# EAGLE design receiver (EAGLE 7.4.0)
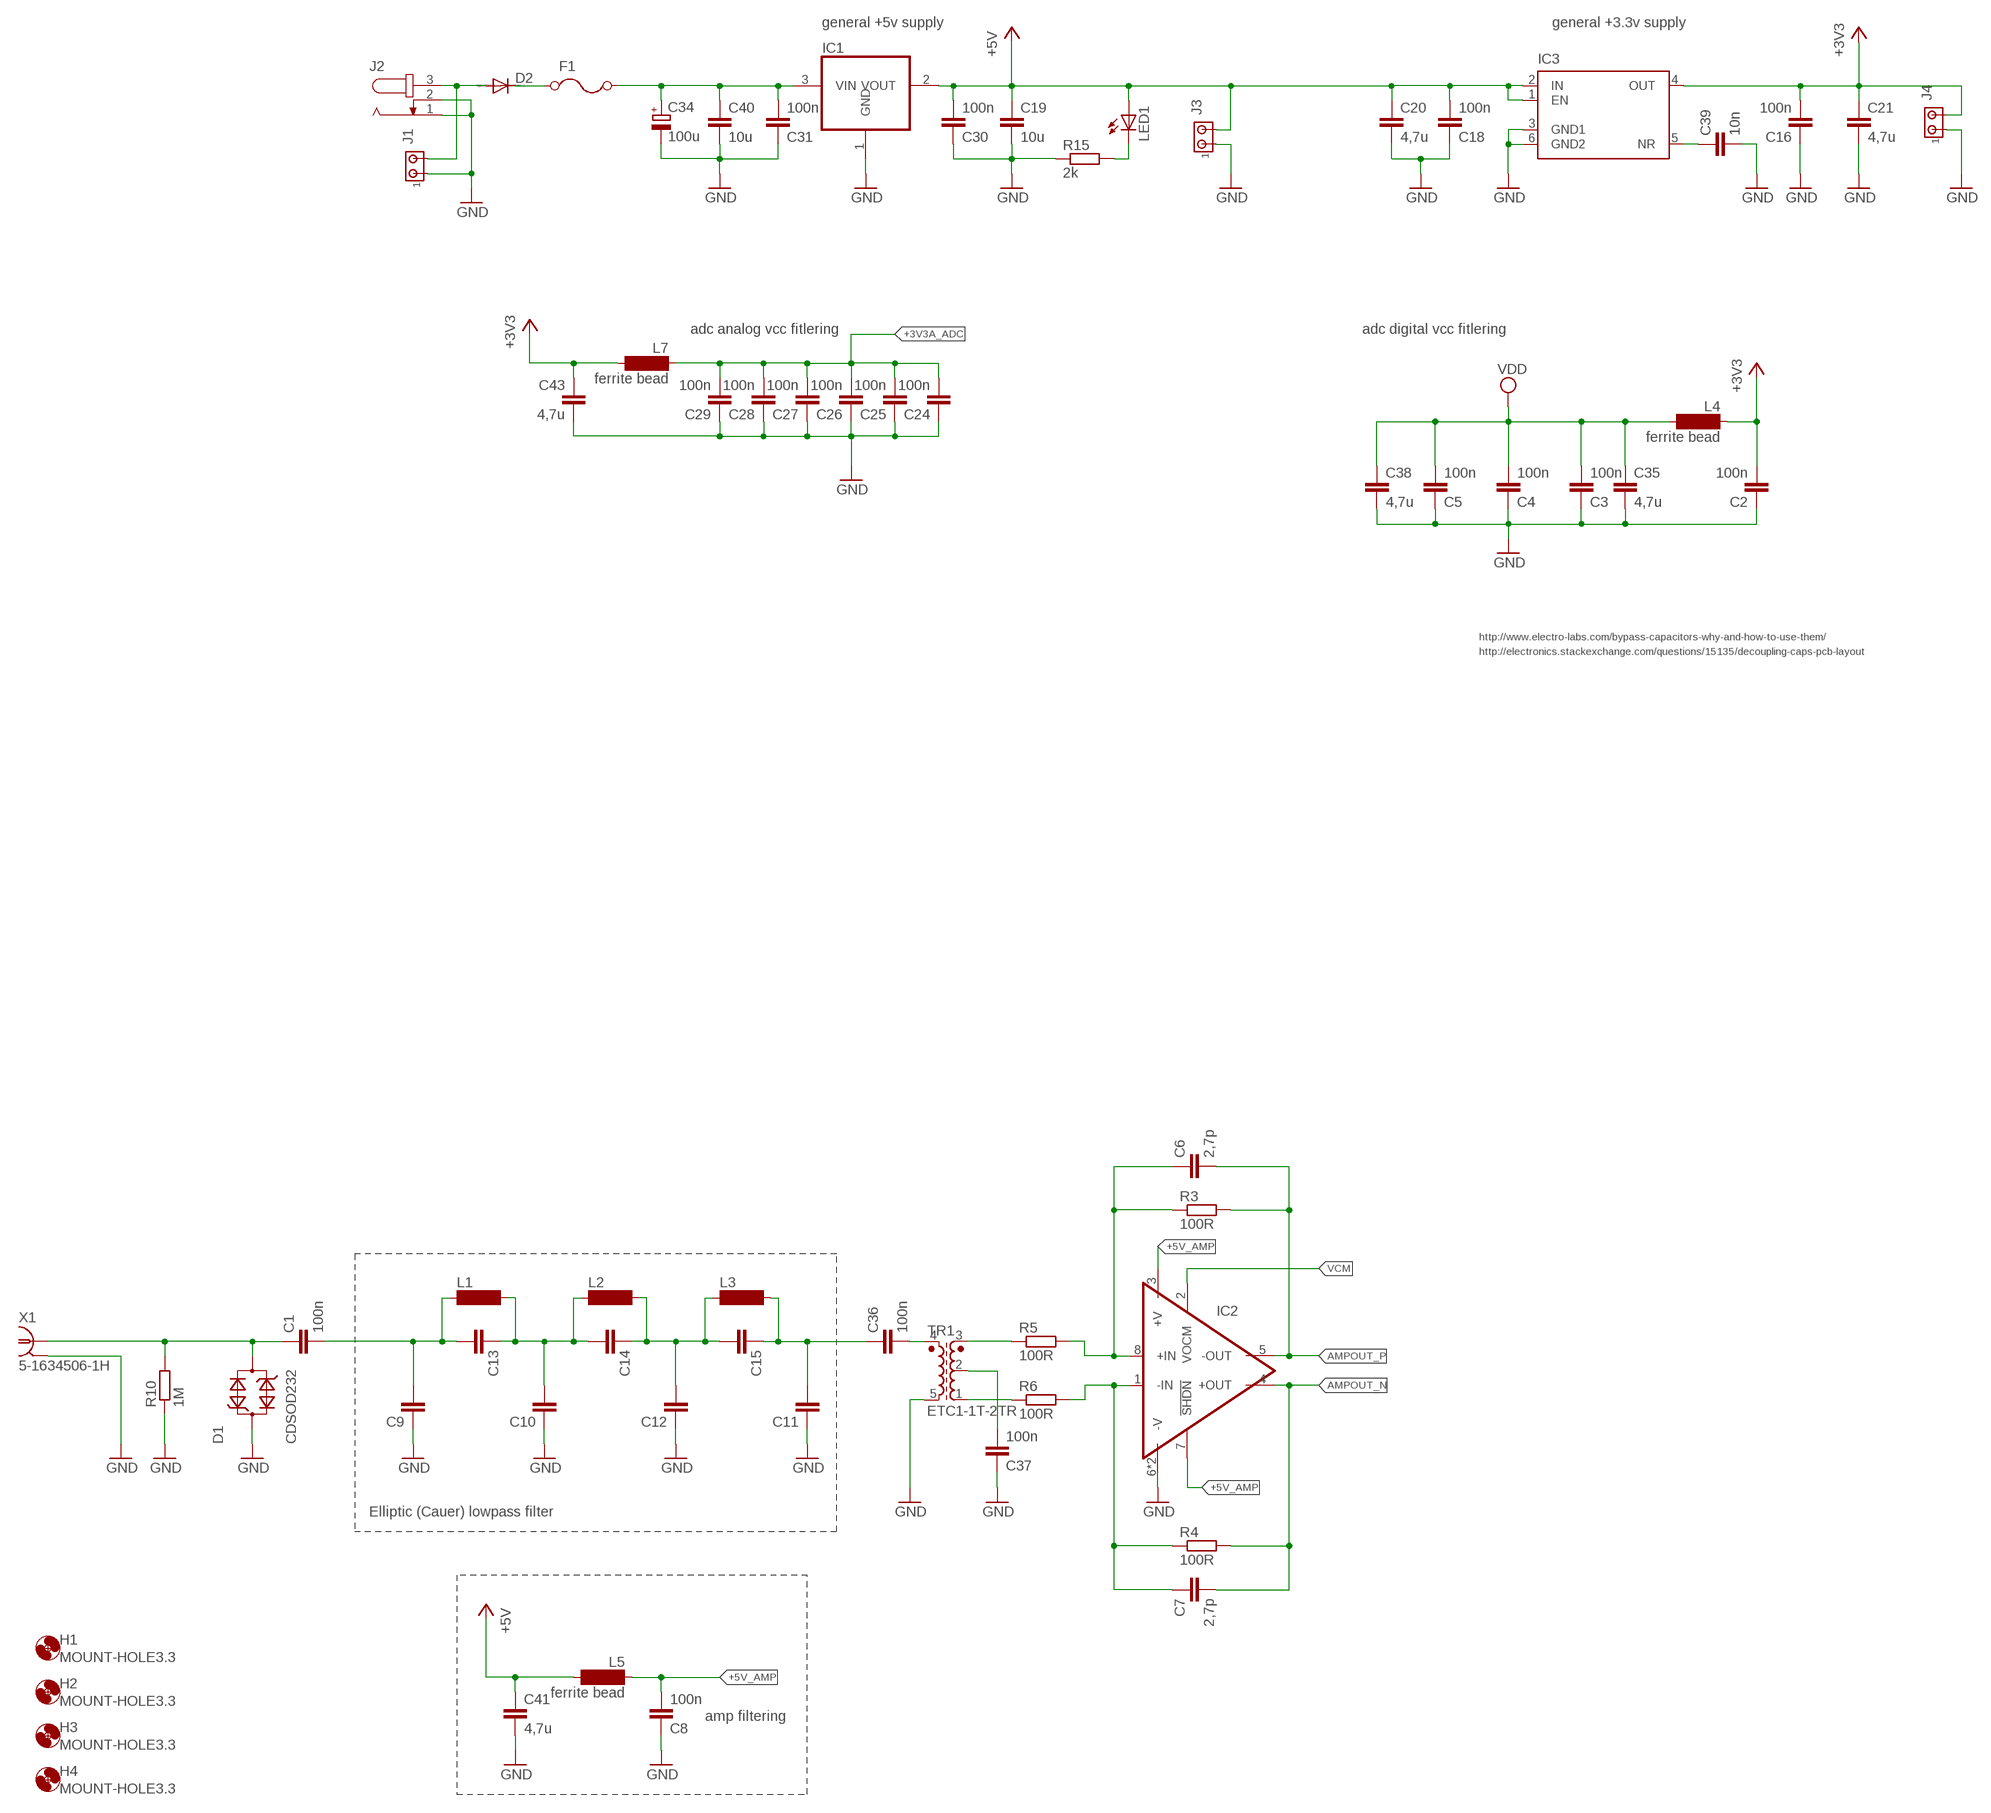
[diagram p0: schematic, sheet 1, part 1 of 2]
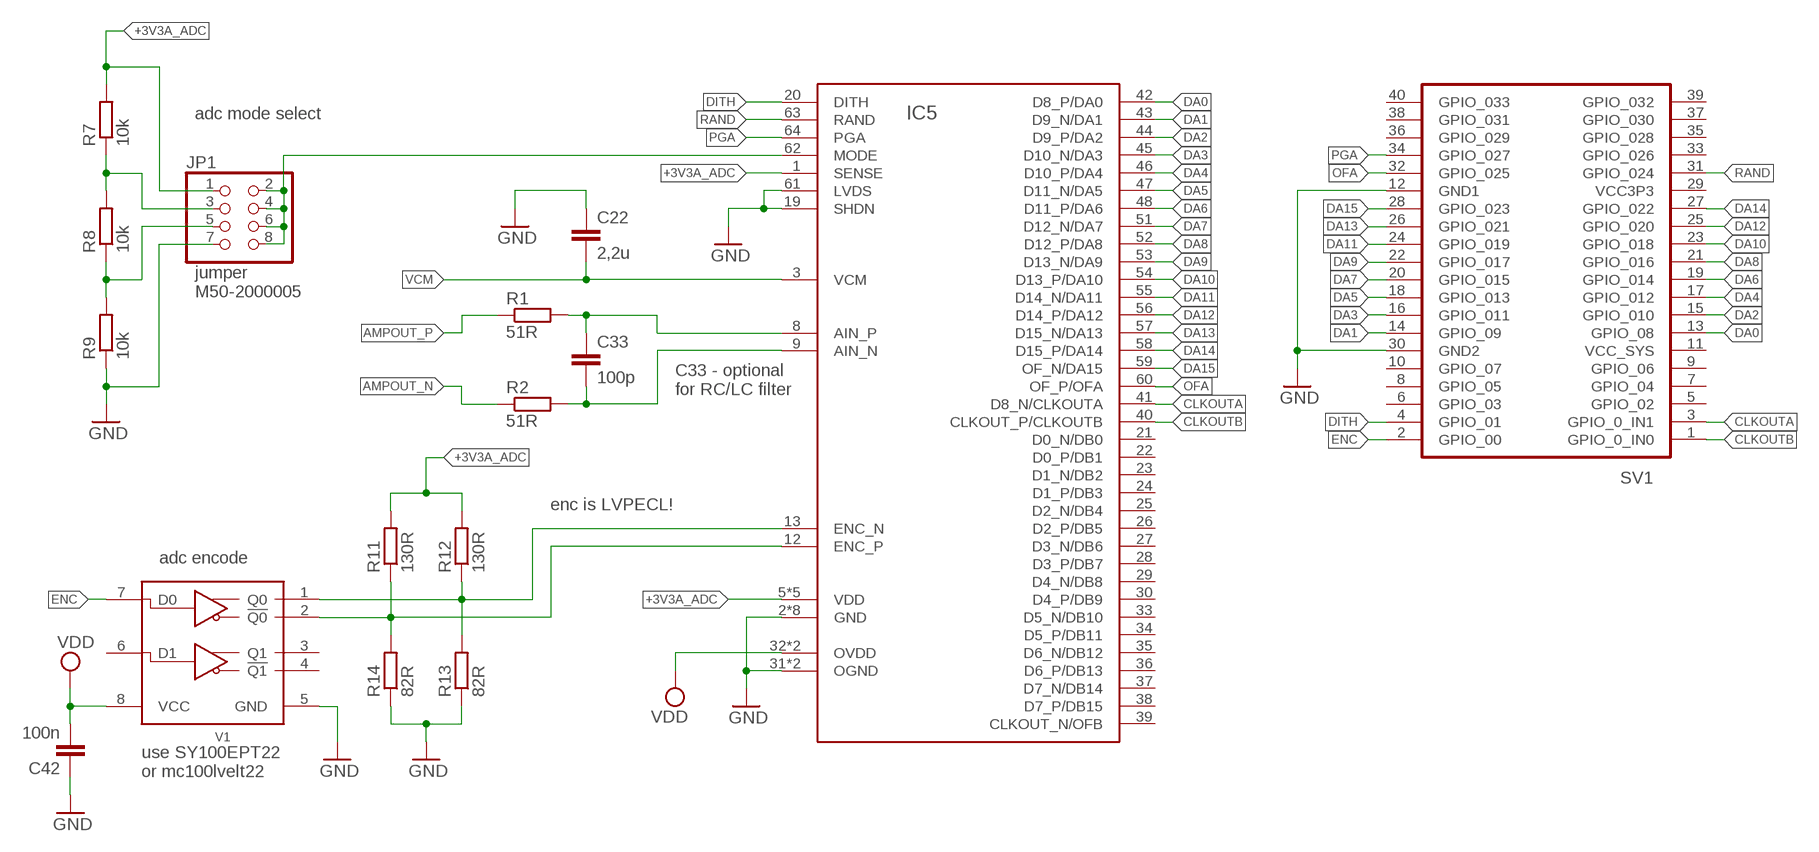
[diagram p1: schematic, sheet 1, part 2 of 2]

## Parts
C1  100n  C-EUC0805  [C0805]
C2  100n  C-EUC0805  [C0805]
C3  100n  C-EUC0805  [C0805]
C4  100n  C-EUC0805  [C0805]
C5  100n  C-EUC0805  [C0805]
C6  2,7p  C-EUC0805  [C0805]
C7  2,7p  C-EUC0805  [C0805]
C8  100n  C-EUC0805  [C0805]
C9  C-EUC0805  [C0805]
C10  C-EUC0805  [C0805]
C11  C-EUC0805  [C0805]
C12  C-EUC0805  [C0805]
C13  C-EUC0805  [C0805]
C14  C-EUC0805  [C0805]
C15  C-EUC0805  [C0805]
C16  100n  C-EUC0805  [C0805]
C18  100n  C-EUC0805  [C0805]
C19  10u  C-EUC0805  [C0805]
C20  4,7u  C-EUC0805  [C0805]
C21  4,7u  C-EUC0805  [C0805]
C22  2,2u  C-EUC0805  [C0805]
C24  100n  C-EUC0805  [C0805]
C25  100n  C-EUC0805  [C0805]
C26  100n  C-EUC0805  [C0805]
C27  100n  C-EUC0805  [C0805]
C28  100n  C-EUC0805  [C0805]
C29  100n  C-EUC0805  [C0805]
C30  100n  C-EUC0805  [C0805]
C31  100n  C-EUC0805  [C0805]
C33  100p  C-EUC0805  [C0805]
C34  100u  CPOL-EU153CLV-0605  [153CLV-0605]
C35  4,7u  C-EUC0805  [C0805]
C36  100n  C-EUC0805  [C0805]
C37  100n  C-EUC0805  [C0805]
C38  4,7u  C-EUC0805  [C0805]
C39  10n  C-EUC0805  [C0805]
C40  10u  C-EUC0805  [C0805]
C41  4,7u  C-EUC0805  [C0805]
C42  100n  C-EUC0805  [C0805]
C43  4,7u  C-EUC0805  [C0805]
D1  CDSOD232  [SOD323]
D2  DIODE-DO214AC  [DO214AC]
F1  0ZCG0150BF2C  [CN1812]
H1  MOUNT-HOLE3.3  [3,3]
H2  MOUNT-HOLE3.3  [3,3]
H3  MOUNT-HOLE3.3  [3,3]
H4  MOUNT-HOLE3.3  [3,3]
IC1  REG1117  [DPAK]
IC2  LTC6405  [MSOP8_TH]
IC3  TPS73733  [SOT223-6]
IC5  LTC2208_FLAT  [QFN64]
J1  MTA02-100  [10X02MTA]
J2  JACK-PLUG0  [SPC4077]
J3  MTA02-100  [10X02MTA]
J4  MTA02-100  [10X02MTA]
JP1  PINHD-2X4  [2X04_SMD]
L1  SM-NE29  [SM-NE29]
L2  SM-NE29  [SM-NE29]
L3  SM-NE29  [SM-NE29]
L4  ferrite bead  SM-NE29  [SM-NE29]
L5  ferrite bead  SM-NE29  [SM-NE29]
L7  ferrite bead  SM-NE29  [SM-NE29]
LED1  LEDSML0805  [SML0805]
R1  51R  R-EU_M0805  [M0805]
R2  51R  R-EU_M0805  [M0805]
R3  100R  R-EU_M0805  [M0805]
R4  100R  R-EU_M0805  [M0805]
R5  100R  R-EU_M0805  [M0805]
R6  100R  R-EU_M0805  [M0805]
R7  10k  R-EU_M0805  [M0805]
R8  10k  R-EU_M0805  [M0805]
R9  10k  R-EU_M0805  [M0805]
R10  1M  R-EU_R0805  [R0805]
R11  130R  R-EU_M1206  [M1206]
R12  130R  R-EU_M1206  [M1206]
R13  82R  R-EU_M1206  [M1206]
R14  82R  R-EU_M1206  [M1206]
R15  2k  R-EU_M0805  [M0805]
SV1  PINHEADER  [2X20]
TR1  ETC1-1T-2TR  [ETC1-1T-2TR]
V1  SY100EPT22  [SOIC8]
X1  5-1634506-1H  [5-1634506-1]

## Nets
12-18V: D2.A J1.2 J2.3
+3V3: C2.2 C16.2 C21.1 C43.1 IC3.4(OUT) J4.2 L4.1 L7.2
+3V3A_ADC: C24.2 C25.2 C26.2 C27.2 C28.2 C29.2 IC5.1(SENSE) IC5.5(VDD) IC5.6(VDD) IC5.15(VDD) IC5.16(VDD) IC5.17(VDD) JP1.1 L7.1 R7.2 R11.2 R12.2
+5V: C18.2 C19.1 C20.1 C30.2 C41.1 IC1.2(VOUT) IC3.1(EN) IC3.2(IN) J3.2 L5.2 LED1.A
+5V_AMP: C8.2 IC2.3(+V) IC2.7(!SHDN) L5.1
AMPOUT_N: C7.2 IC2.4(+OUT) R2.1 R4.2
AMPOUT_P: C6.2 IC2.5(-OUT) R1.1 R3.2
CLKOUTA: IC5.41(D8_N/CLKOUTA) SV1.3(GPIO_0_IN1)
CLKOUTB: IC5.40(CLKOUT_P/CLKOUTB) SV1.1(GPIO_0_IN0)
DA0: IC5.42(D8_P/DA0) SV1.13(GPIO_08)
DA1: IC5.43(D9_N/DA1) SV1.14(GPIO_09)
DA2: IC5.44(D9_P/DA2) SV1.15(GPIO_010)
DA3: IC5.45(D10_N/DA3) SV1.16(GPIO_011)
DA4: IC5.46(D10_P/DA4) SV1.17(GPIO_012)
DA5: IC5.47(D11_N/DA5) SV1.18(GPIO_013)
DA6: IC5.48(D11_P/DA6) SV1.19(GPIO_014)
DA7: IC5.51(D12_N/DA7) SV1.20(GPIO_015)
DA8: IC5.52(D12_P/DA8) SV1.21(GPIO_016)
DA9: IC5.53(D13_N/DA9) SV1.22(GPIO_017)
DA10: IC5.54(D13_P/DA10) SV1.23(GPIO_018)
DA11: IC5.55(D14_N/DA11) SV1.24(GPIO_019)
DA12: IC5.56(D14_P/DA12) SV1.25(GPIO_020)
DA13: IC5.57(D15_N/DA13) SV1.26(GPIO_021)
DA14: IC5.58(D15_P/DA14) SV1.27(GPIO_022)
DA15: IC5.59(OF_N/DA15) SV1.28(GPIO_023)
DITH: IC5.20(DITH) SV1.4(GPIO_01)
ENC: SV1.2(GPIO_00) V1.7(D0)
ENC_N: IC5.12(ENC_P) R11.1 R14.2 V1.2(!Q0)
ENC_P: IC5.13(ENC_N) R12.1 R13.2 V1.1(Q0)
FILTERED_RF: C11.2 C15.1 C36.1 L3.2
GND: C2.1 C3.1 C4.1 C5.1 C8.1 C9.1 C10.1 C11.1 C12.1 C16.1 C18.1 C19.2 C20.2 C21.2 C22.1 C24.1 C25.1 C26.1 C27.1 C28.1 C29.1 C30.1 C31.1 C34.- C35.2 C37.1 C38.2 C39.2 C40.2 C41.2 C42.1 C43.2 D1.1 IC1.1(GND) IC2.6(-V) IC2.9(-V) IC3.3(GND1) IC3.6(GND2) IC5.2(GND) IC5.4(GND) IC5.7(GND) IC5.10(GND) IC5.11(GND) IC5.14(GND) IC5.18(GND) IC5.19(SHDN) IC5.31(OGND) IC5.50(OGND) IC5.61(LVDS) IC5.65(GND) J1.1 J2.1 J2.2 J3.1 J4.1 JP1.7 R9.1 R10.1 R13.1 R14.1 R15.1 SV1.12(GND1) SV1.30(GND2) TR1.5 V1.5(GND) X1.2 X1.3 X1.4 X1.5
IN_N: C33.2 IC5.9(AIN_N) R2.2
IN_P: C33.1 IC5.8(AIN_P) R1.2
MODE: IC5.62(MODE) JP1.2 JP1.4 JP1.6 JP1.8
N$1: R5.1 TR1.3
N$2: C1.1 D1.2 R10.2 X1.1
N$3: C36.2 TR1.4
N$4: C6.1 IC2.8(+IN) R3.1 R5.2
N$5: C7.1 IC2.1(-IN) R4.1 R6.2
N$6: JP1.3 R7.1 R8.2
N$7: C31.2 C34.+ C40.1 F1.P$2 IC1.3(VIN)
N$9: JP1.5 R8.1 R9.2
N$12: LED1.C R15.2
N$13: D2.C F1.P$1
N$14: R6.1 TR1.1
N$15: C37.2 TR1.2
N$16: C1.2 C9.2 C13.2 L1.1
N$17: C10.2 C13.1 C14.2 L1.2 L2.1
N$18: C12.2 C14.1 C15.2 L2.2 L3.1
N$19: C39.1 IC3.5(NR)
OFA: IC5.60(OF_P/OFA) SV1.32(GPIO_025)
PGA: IC5.64(PGA) SV1.34(GPIO_027)
RAND: IC5.63(RAND) SV1.31(GPIO_024)
VCM: C22.2 IC2.2(VOCM) IC5.3(VCM)
VDD: C3.2 C4.2 C5.2 C35.1 C38.1 C42.2 IC5.32(OVDD) IC5.49(OVDD) L4.2 V1.8(VCC)
Unconnected: IC5.21(D0_N/DB0) IC5.22(D0_P/DB1) IC5.23(D1_N/DB2) IC5.24(D1_P/DB3) IC5.25(D2_N/DB4) IC5.26(D2_P/DB5) IC5.27(D3_N/DB6) IC5.28(D3_P/DB7) IC5.29(D4_N/DB8) IC5.30(D4_P/DB9) IC5.33(D5_N/DB10) IC5.34(D5_P/DB11) IC5.35(D6_N/DB12) IC5.36(D6_P/DB13) IC5.37(D7_N/DB14) IC5.38(D7_P/DB15) IC5.39(CLKOUT_N/OFB) SV1.5(GPIO_02) SV1.6(GPIO_03) SV1.7(GPIO_04) SV1.8(GPIO_05) SV1.9(GPIO_06) SV1.10(GPIO_07) SV1.33(GPIO_026) SV1.35(GPIO_028) SV1.36(GPIO_029) SV1.37(GPIO_030) SV1.38(GPIO_031) SV1.39(GPIO_032) SV1.40(GPIO_033) V1.3(Q1) V1.4(!Q1) V1.6(D1)

## Notes on the sheet
- general +5v supply | general +3.3v supply
- adc analog vcc fitlering | adc digital vcc fitlering
- http://www.electro-labs.com/bypass-capacitors-why-and-how-to-use-them/
- http://electronics.stackexchange.com/questions/15135/decoupling-caps-pcb-layout
- adc mode select
- jumper
  M50-2000005
- C33 - optional
  for RC/LC filter
- Elliptic (Cauer) lowpass filter
- enc is LVPECL!
- adc encode
- amp filtering
- use SY100EPT22
  or mc100lvelt22

## Power pins joined to a net without a drawn wire
VCC3P3: SV1.29(VCC3P3)
VCC_SYS: SV1.11(VCC_SYS)

## Library data of the parts
C1-C5 C8 C16 C18 C24-C31 C36 C37 C42 = rcl:C-EU: CAPACITOR, European symbol; MFR: C0805C104K5RACTU
C6 C7 = rcl:C-EU: CAPACITOR, European symbol; MFR: VJ0805A2R7BXQPW1BC
C9-C15 = rcl:C-EU: CAPACITOR, European symbol
C19 = rcl:C-EU: CAPACITOR, European symbol; MFR: VJ0805G106KXQTW1BC
C20 = rcl:C-EU: CAPACITOR, European symbol; MFR: 08056D475KAT2A
C21 C35 C38 C41 C43 = rcl:C-EU: CAPACITOR, European symbol; MFR: JMK212BJ475KG-T
C22 = rcl:C-EU: CAPACITOR, European symbol; MFR: VJ0805G225KXQTW1BC
C33 = rcl:C-EU: CAPACITOR, European symbol; MFR: C0805C101J5GACTU
C34 = rcl:CPOL-EU: POLARIZED CAPACITOR, European symbol; MFR: VE-470M1ETR-0605
C39 = rcl:C-EU: CAPACITOR, European symbol; MFR: C0805C103K5RACTU
C40 = rcl:C-EU: CAPACITOR, European symbol; MFR: GRM21BR61E106MA73L
D1 = lstolcman_thesis:CDSOD232; MFR: CDSOD323-T03C
D2 = diode:DIODE-: DIODE; MFR: SSA33L-E3/5AT
F1 = lstolcman_thesis:0ZCG0150BF2C; MFR: 0ZCG0150BF2C
H1-H4 = holes:MOUNT-HOLE: MOUNTING HOLE with drill center marker
IC1 = lstolcman_thesis:REG1117: 800mA and 1A Low Dropout (LDO) Positive Regulator 1.8V, 2.5V, 2.85V, 3.3V, 5V, and Adj; MFR: NCP1117DT50G; SUP: tme
IC2 = lstolcman_thesis:LTC6405; MFR: LTC6405IMS8E
IC3 = lstolcman_thesis:TPS73733; MFR: 595-TPS73733DCQR
IC5 = lstolcman_thesis:LTC2208_FLAT; MFR: LTC2208CUP
J1 J3 J4 = con-amp:MTA02-100: AMP connector; MFR: 640454-2; SUP: tme
J2 = con-jack:JACK-PLUG: DC POWER JACK Power Jack, DC, Right Angle, Through Hole, Rated 5A at 16VDC, PC Terminals Distributor: Farnell (www.Farnell.de) Drawing: 84N1161.pdf / 84N1162.pdf Manufacturer: SPC Technology (www.spctechnology.com) Type: SPC4077 / SPC 4078; MFR: FC68148; OC_FARNELL: unknown; OC_NEWARK: unknown; SUP: tme
JP1 = lstolcman_thesis:PINHD-2X4: PIN HEADER; MFR: 20021121-00008C4LF
L1-L3 = inductor-neosid:SM-NE29: INDUCTOR SMD chip inductor; OC_FARNELL: unknown; OC_NEWARK: unknown
L4 L5 L7 = inductor-neosid:SM-NE29: INDUCTOR SMD chip inductor; MFR: 2508056017Y2; OC_FARNELL: unknown; OC_NEWARK: unknown
LED1 = led:LED: LED OSRAM: - CHIPLED LG R971, LG N971, LY N971, LG Q971, LY Q971, LO R971, LY R971 LH N974, LH R974 LS Q976, LO Q976, LY Q976 LO Q996 - Hyper CHIPLED LW Q18S LB Q993, LB Q99A, LB R99A - SideLED LS A670, LO A670, LY A670, LG A670, LP A670 LB A673, LV A673, LT A673, LW A673 LH A674 LY A675 LS A676, LA A676, LO A676, LY A676, LW A676 LS A679, LY A679, LG A679 - Hyper Micro SIDELED® LS Y876, LA Y876, LO Y876, LY Y876 LT Y87S - SmartLED LW L88C, LW L88S LB L89C, LB L89S, LG L890 LS L89K, LO L89K, LY L89K LS L896, LA L896, LO L896, LY L896 - TOPLED LS T670, LO T670, LY T670, LG T670, LP T670 LSG T670, LSP T670, LSY T670, LOP T670, LYG T670 LG T671, LOG T671, LSG T671 LB T673, LV T673, LT T673, LW T673 LH T674 LS T676, LA T676, LO T676, LY T676, LB T676, LH T676, LSB T676, LW T676 LB T67C, LV T67C, LT T67C, LS T67K, LO T67K, LY T67K, LW E67C LS E67B, LA E67B, LO E67B, LY E67B, LB E67C, LV E67C, LT E67C LW T67C LS T679, LY T679, LG T679 LS T770, LO T770, LY T770, LG T770, LP T770 LB T773, LV T773, LT T773, LW T773 LH T774 LS E675, LA E675, LY E675, LS T675 LS T776, LA T776, LO T776, LY T776, LB T776 LHGB T686 LT T68C, LB T68C - Hyper Mini TOPLED® LB M676 - Mini TOPLED Santana® LG M470 LS M47K, LO M47K, LY M47K Source: http://www.osram.convergy.de LUXEON: - LUMILED® LXK2-PW12-R00, LXK2-PW12-S00, LXK2-PW14-U00, LXK2-PW14-V00 LXK2-PM12-R00, LXK2-PM12-S00, LXK2-PM14-U00 LXK2-PE12-Q00, LXK2-PE12-R00, LXK2-PE12-S00, LXK2-PE14-T00, LXK2-PE14-U00 LXK2-PB12-K00, LXK2-PB12-L00, LXK2-PB12-M00, LXK2-PB14-N00, LXK2-PB14-P00, LXK2-PB14-Q00 LXK2-PR12-L00, LXK2-PR12-M00, LXK2-PR14-Q00, LXK2-PR14-R00 LXK2-PD12-Q00, LXK2-PD12-R00, LXK2-PD12-S00 LXK2-PH12-R00, LXK2-PH12-S00 LXK2-PL12-P00, LXK2-PL12-Q00, LXK2-PL12-R00 Source: www.luxeon.com KINGBRIGHT: KA-3528ASYC Source: www.kingbright.com; MFR: 720-LGR971-KN-1
R1 R2 = rcl:R-EU_: RESISTOR, European symbol; MFR: RC0805FR-0751RL
R3-R6 = rcl:R-EU_: RESISTOR, European symbol; MFR: RC0805FR-07100RL
R7-R9 = rcl:R-EU_: RESISTOR, European symbol; MFR: RC0805FR-0710KL
R10 = rcl:R-EU_: RESISTOR, European symbol; MFR: RC0805FR-071ML
R11 R12 = rcl:R-EU_: RESISTOR, European symbol; MFR: ERJ-8ENF1300V
R13 R14 = rcl:R-EU_: RESISTOR, European symbol; MFR: RC1206JR-0782RL
R15 = rcl:R-EU_: RESISTOR, European symbol; MFR: RC0805FR-072K2L
SV1 = lstolcman_thesis:PINHEADER; MFR: ZL262-40DG; SUP: tme
TR1 = lstolcman_thesis:ETC1-1T-2TR: TRANSFORMER SMD transformer acc. to customer specification; MFR: ETC1-1T-2TR
V1 = lstolcman_thesis:SY100EPT22; MFR: SY100EPT22VZG-TR
X1 = lstolcman_thesis:5-1634506-1: BNC CONNECTOR M/A COM www.macom.com; MFR: 5-1634506-1

## Board
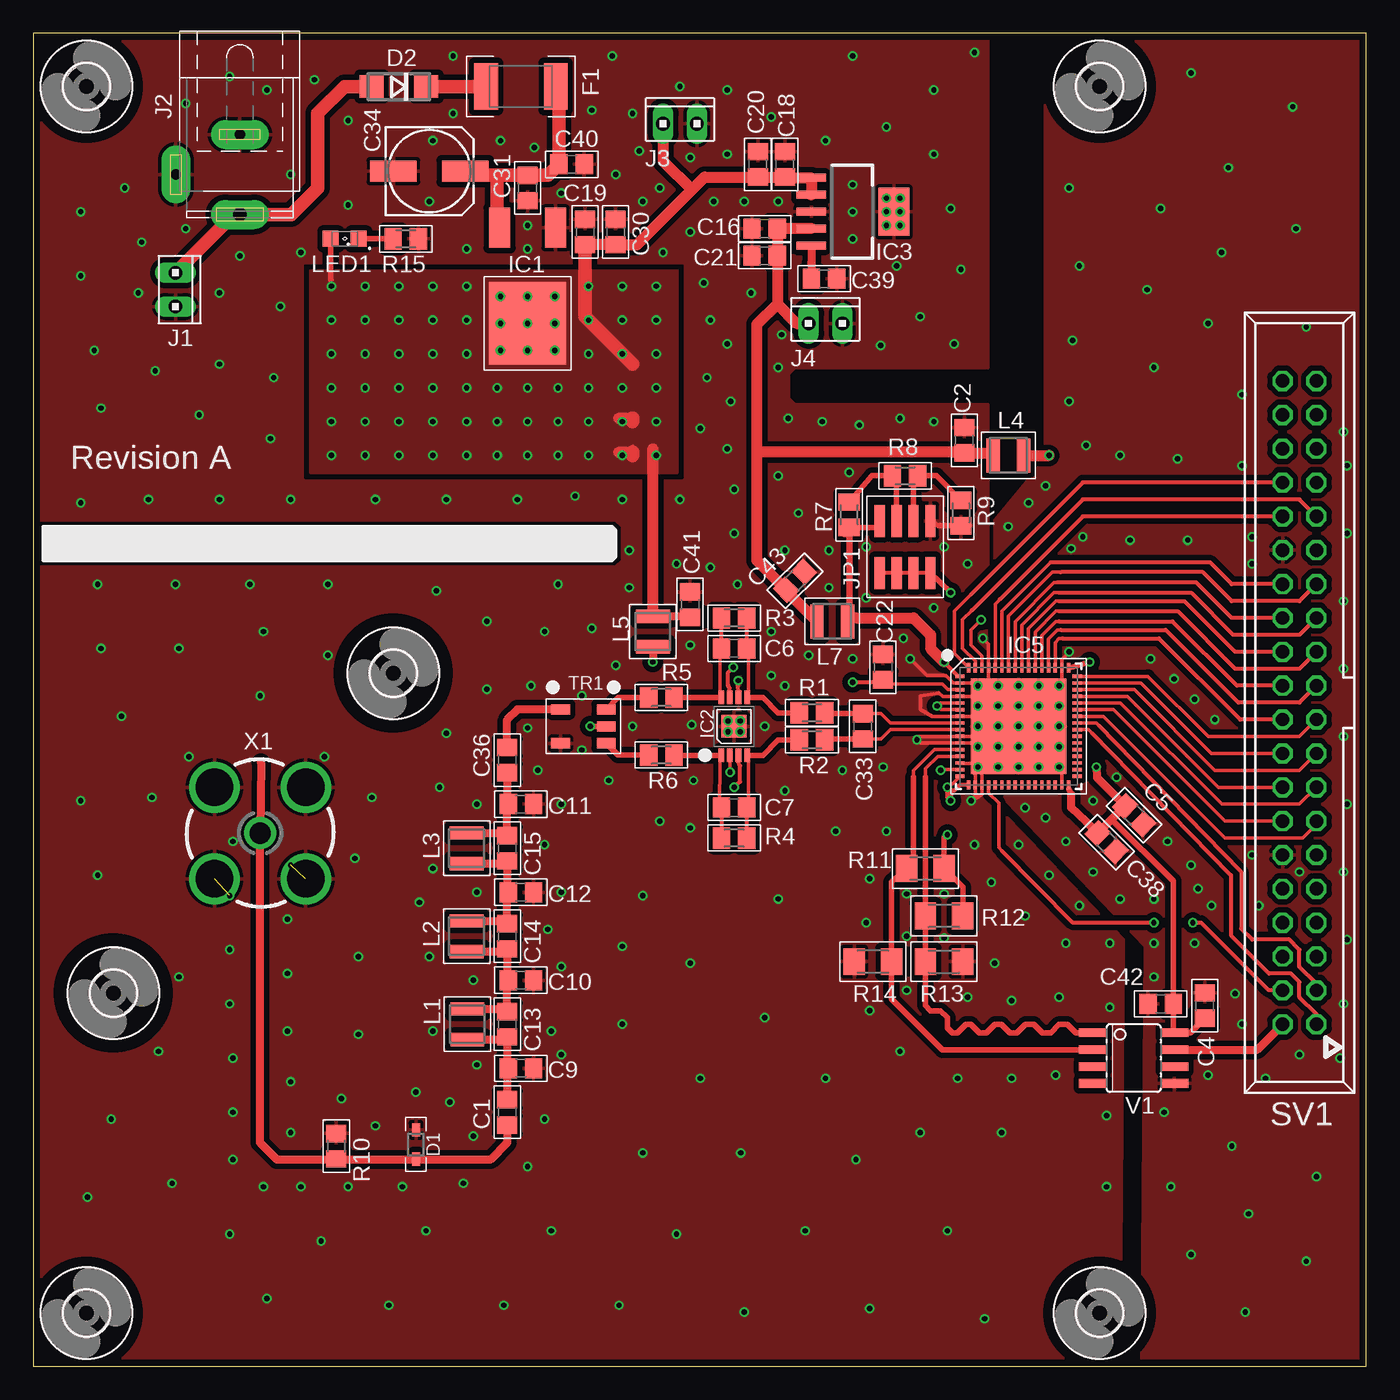
[diagram p2: board, top side]
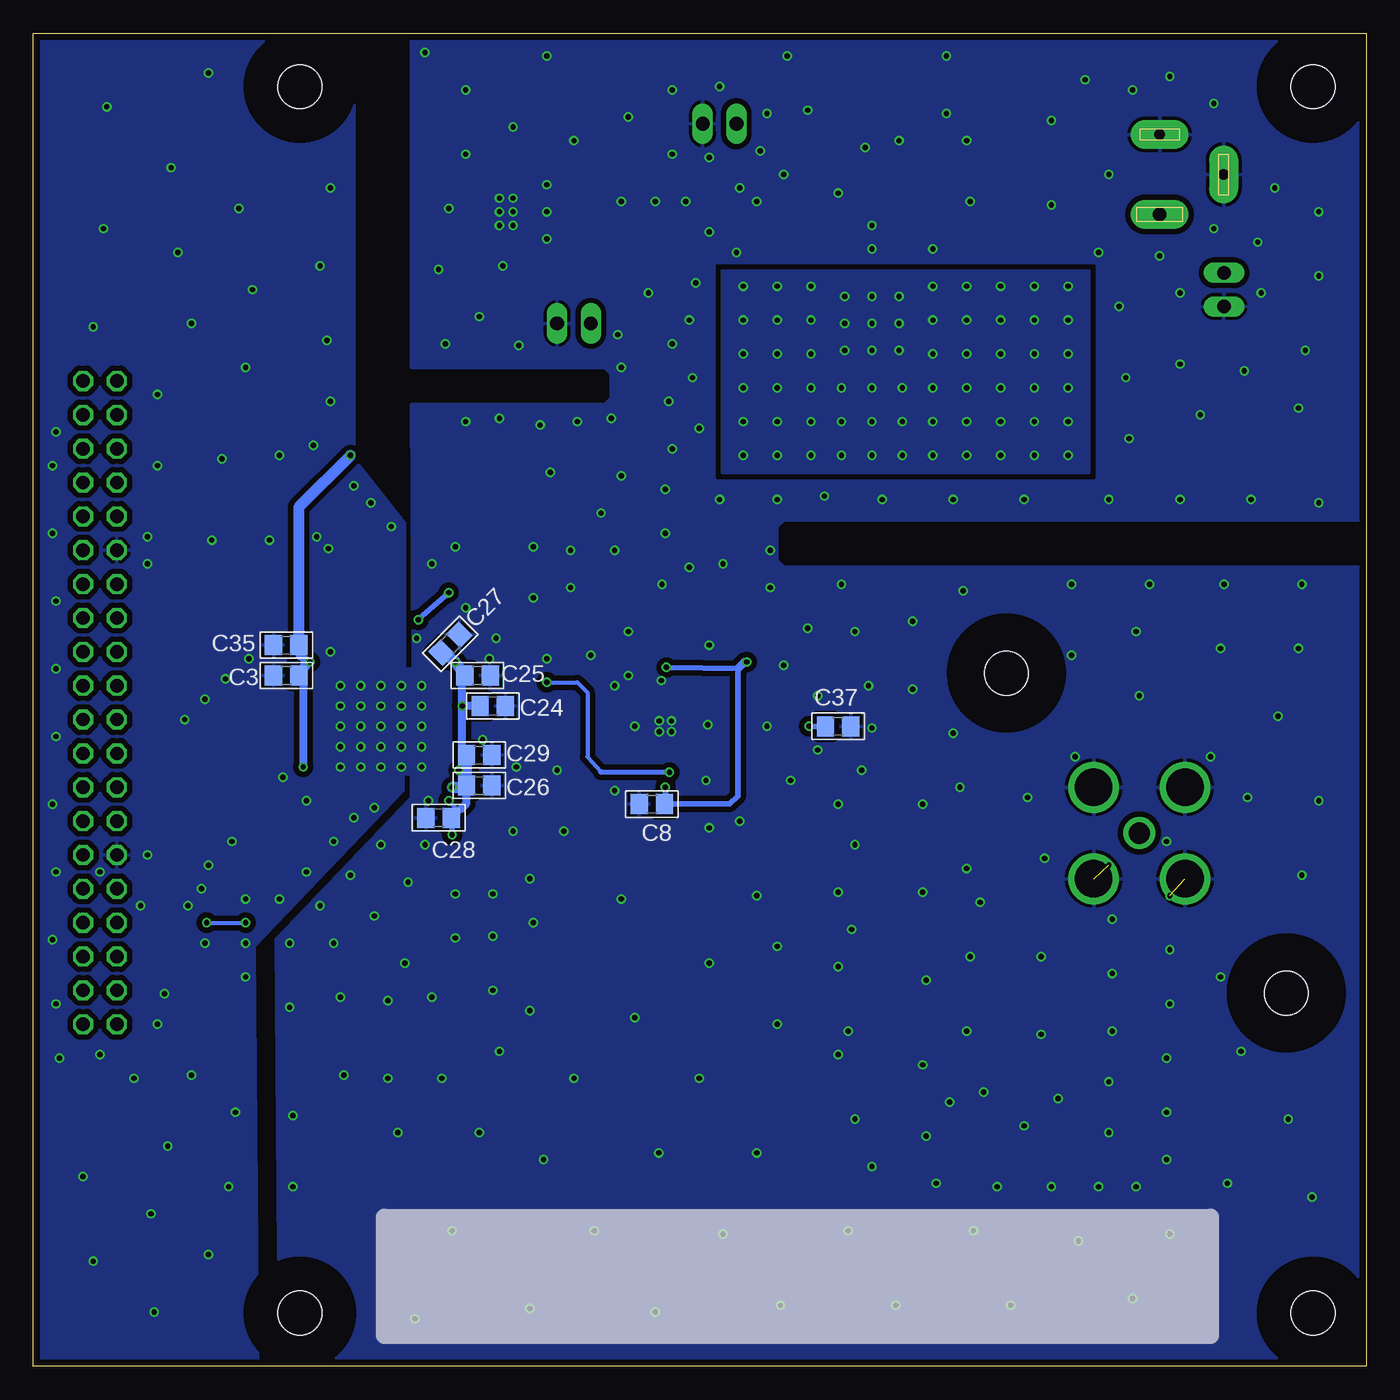
[diagram p3: board, bottom side, seen from below]

Size 100 x 100 mm. Coordinates in mm from the lower left corner, seen from the top.
Outline: 0,0 100,0 100,100 0,100 0,0
Copper layers (1*16): Top 0.035mm / dielectric 1.6mm / Bottom 0.035mm
Design rules "Elecrow_2-layer_PCB_eagle_rule": minimum track width 6mil, minimum drill 12mil, track to track 6mil, track to pad 6mil, pad to pad 6mil, via to via 8mil, smd to smd 0mil, copper to edge 20mil, drill to drill 10mil, minimum pad ring 6mil, minimum via ring 6mil, stop-mask expansion 0mil, vias tented up to drill 100mil, thermal gap 10mil

### Footprints (pad centres in the part's own frame; a part is rotated, then mirrored left to right if it is on the bottom)
C0805 = smd 1.3 x 1.5: 1 -0.95,0; 2 0.95,0
153CLV-0605 = smd 3.5 x 1.6: + 2.7,0; - -2.7,0
SOD323 = smd 1 x 0.6: 1 -1.1,0; 2 1.1,0
DO214AC = smd 1.8 x 1.7: A 2.05,0; C -2.05,0
CN1812 = smd 1.78 x 3.5: P$1 -2.615,0; P$2 2.615,0
3,3 = hole 3.3: 0,0
3,3@1 = hole 3.3: 0,0
DPAK = smd 3 x 1.6: 1 7.18,-2.1; 3 7.18,2.1 | smd 6.2 x 5.8: 2 0,0
MSOP8_TH = smd 0.42 x 1: 1 -0.975,-2.17; 2 -0.325,-2.17; 3 0.325,-2.17; 4 0.975,-2.17; 5 0.975,2.17; 6 0.325,2.17; 7 -0.325,2.17; 8 -0.975,2.17 | smd 1.88 x 1.68: 9 0,0
SOT223-6 = smd 0.6 x 2.2: 1 -2.54,-3.1; 2 -1.27,-3.1; 3 0,-3.1; 4 1.27,-3.1; 5 2.54,-3.1 | smd 3.6 x 2.3: 6 0,3.1
QFN64 = smd 0.7 x 0.25: 1 -4.4,3.75; 2 -4.4,3.25; 3 -4.4,2.75; 4 -4.4,2.25; 5 -4.4,1.75; 6 -4.4,1.25; 7 -4.4,0.75; 8 -4.4,0.25; 9 -4.4,-0.25; 10 -4.4,-0.75; 11 -4.4,-1.25; 12 -4.4,-1.75; 13 -4.4,-2.25; 14 -4.4,-2.75; 15 -4.4,-3.25; 16 -4.4,-3.75; 33 4.4,-3.75; 34 4.4,-3.25; 35 4.4,-2.75; 36 4.4,-2.25; 37 4.4,-1.75; 38 4.4,-1.25; 39 4.4,-0.75; 40 4.4,-0.25; 41 4.4,0.25; 42 4.4,0.75; 43 4.4,1.25; 44 4.4,1.75; 45 4.4,2.25; 46 4.4,2.75; 47 4.4,3.25; 48 4.4,3.75 | smd 0.25 x 0.7: 17 -3.75,-4.4; 18 -3.25,-4.4; 19 -2.75,-4.4; 20 -2.25,-4.4; 21 -1.75,-4.4; 22 -1.25,-4.4; 23 -0.75,-4.4; 24 -0.25,-4.4; 25 0.25,-4.4; 26 0.75,-4.4; 27 1.25,-4.4; 28 1.75,-4.4; 29 2.25,-4.4; 30 2.75,-4.4; 31 3.25,-4.4; 32 3.75,-4.4; 49 3.75,4.4; 50 3.25,4.4; 51 2.75,4.4; 52 2.25,4.4; 53 1.75,4.4; 54 1.25,4.4; 55 0.75,4.4; 56 0.25,4.4; 57 -0.25,4.4; 58 -0.75,4.4; 59 -1.25,4.4; 60 -1.75,4.4; 61 -2.25,4.4; 62 -2.75,4.4; 63 -3.25,4.4; 64 -3.75,4.4 | smd 7.15 x 7.15: 65 0,0
10X02MTA = drill 1.016 long: 1 1.27,0; 2 -1.27,0
SPC4077 = drill 0.8 pad 2.184 long: 1 -3,0; 2 0,-4.8 | drill 1 pad 2.184 long: 3 3,0
2X04_SMD = smd 0.76 x 2.4: 1 3.81,-1.95; 2 0,1.95; 3 2.54,-1.95; 4 1.27,1.95; 5 1.27,-1.95; 6 2.54,1.95; 7 0,-1.95; 8 3.81,1.95
SM-NE29 = smd 1 x 2.54: 1 -1.15,0; 2 1.15,0
SML0805 = smd 1.2 x 1.2: A 1.05,0; C -1.05,0
M0805 = smd 1.3 x 1.6: 1 -0.95,0; 2 0.95,0
R0805 = smd 1.3 x 1.5: 1 -0.95,0; 2 0.95,0
M1206 = smd 1.6 x 2: 1 -1.4,0; 2 1.4,0
2X20 = drill 1 octagon: 1 -24.13,-1.27; 2 -24.13,1.27; 3 -21.59,-1.27; 4 -21.59,1.27; 5 -19.05,-1.27; 6 -19.05,1.27; 7 -16.51,-1.27; 8 -16.51,1.27; 9 -13.97,-1.27; 10 -13.97,1.27; 11 -11.43,-1.27; 12 -11.43,1.27; 13 -8.89,-1.27; 14 -8.89,1.27; 15 -6.35,-1.27; 16 -6.35,1.27; 17 -3.81,-1.27; 18 -3.81,1.27; 19 -1.27,-1.27; 20 -1.27,1.27; 21 1.27,-1.27; 22 1.27,1.27; 23 3.81,-1.27; 24 3.81,1.27; 25 6.35,-1.27; 26 6.35,1.27; 27 8.89,-1.27; 28 8.89,1.27; 29 11.43,-1.27; 30 11.43,1.27; 31 13.97,-1.27; 32 13.97,1.27; 33 16.51,-1.27; 34 16.51,1.27; 35 19.05,-1.27; 36 19.05,1.27; 37 21.59,-1.27; 38 21.59,1.27; 39 24.13,-1.27; 40 24.13,1.27
ETC1-1T-2TR = smd 0.762 x 1.397: 1 1.27,1.714; 2 0,1.714; 3 -1.27,1.714; 4 -1.27,-1.714; 5 1.27,-1.714
SOIC8 = smd 0.66 x 2.032: 1 -1.905,-3.073; 2 -0.635,-3.073; 3 0.635,-3.073; 4 1.905,-3.073; 5 1.905,3.073; 6 0.635,3.073; 7 -0.635,3.073; 8 -1.905,3.073
5-1634506-1 = drill 1.6: 1 0,0 | drill 2.8: 2 3.43,3.43; 3 -3.43,3.43; 4 -3.43,-3.43; 5 3.43,-3.43

### Placement (x,y rotation side)
C1  35.56,19.05 90 top
C2  69.85,69.47 270 top
C3  81.03,51.82 0 bottom
C4  87.88,27.05 270 top
C5  82.59,41.35 135 top
C6  52.58,53.85 0 top
C7  52.58,41.91 0 top
C8  53.59,42.16 0 bottom
C9  36.58,22.35 180 top
C10  36.58,28.96 180 top
C11  36.58,42.16 180 top
C12  36.58,35.56 180 top
C13  35.56,25.65 270 top
C14  35.56,32.26 270 top
C15  35.56,38.86 270 top
C16  54.86,85.34 0 top
C18  56.39,90.17 270 top
C19  43.69,85.09 90 top
C20  54.36,90.17 90 top
C21  54.86,83.31 180 top
C22  63.75,52.45 270 top
C24  65.53,49.53 180 bottom
C25  66.67,51.82 180 bottom
C26  66.55,43.56 180 bottom
C27  68.71,54.2 225 bottom
C28  69.6,41.15 0 bottom
C29  66.55,45.85 180 bottom
C30  41.4,85.09 270 top
C31  37.08,88.39 90 top
C33  62.23,48.01 270 top
C34  29.72,89.66 0 top
C35  81.03,54.1 180 bottom
C36  35.56,45.47 90 top
C37  39.62,48.01 180 bottom
C38  80.53,39.31 315 top
C39  59.33,81.58 0 top
C40  40.39,90.17 0 top
C41  49.28,57.15 90 top
C42  84.58,27.18 0 top
C43  57.15,58.93 45 top
D1  28.7,16.64 270 top
D2  27.43,96.01 180 top
F1  36.58,96.01 0 top
H1  4,4 0 top
H2  4,96 0 top
H3  80,96 0 top
H4  80,4 0 top
H5  MOUNT-HOLE3.3  [3,3@1]  27,52 0 top
H6  MOUNT-HOLE3.3  [3,3@1]  6,28 0 top
IC1  37.08,78.23 90 top
IC2  52.58,48.01 0 top
IC3  61.47,86.61 270 top
IC5  73.91,48.01 0 top
J1  10.67,80.77 270 top
J2  15.49,89.41 270 top
J3  48.51,93.22 0 top
J4  59.44,78.23 0 top
JP1  67.31,61.47 180 top
L1  32.56,25.65 90 top
L2  32.51,32.26 90 top
L3  32.51,38.86 90 top
L4  73.15,68.33 0 top
L5  46.48,55.12 90 top
L7  59.94,55.88 180 top
LED1  23.37,84.58 180 top
R1  58.42,49.02 0 top
R2  58.42,46.99 0 top
R3  52.58,56.13 0 top
R4  52.58,39.62 0 top
R5  47.12,50.16 0 top
R6  47.12,45.85 0 top
R7  61.21,63.88 270 top
R8  65.41,66.8 180 top
R9  69.6,64.01 90 top
R10  22.73,16.51 270 top
R11  66.93,37.34 0 top
R12  68.33,33.78 0 top
R13  68.33,30.35 180 top
R14  62.99,30.35 0 top
R15  27.94,84.58 180 top
SV1  95,49.78 90 top
TR1  41.27,48.01 270 top
V1  82.55,23.11 270 top
X1  17.02,40 90 top

### Tracks (layer width: path | path; a pad name or v marks a point on that pad's centre or on a via)
12-18V
  Top 1.016: D2.A 23.35,96.01 21.34,94 21.34,88.39 19.35,86.41 J2.3 15.03,86.41 J1.2
+3V3
  Top 0.813: IC3.4 C16.2 C21.1 55.81,79.69 | L4.1 72.06,68.52 C2.2 69.66,68.27 69.09,68.58 54.29,68.58 | 54.29,68.58 54.29,78.17 55.81,79.69 | L7.2 56.48,58.2 C43.1 54.29,60.44 54.29,68.58 | 55.81,79.69 57.27,78.23 J4.2
+3V3A_ADC  (via drill 0.4, 0.4 pad 0.41)
  Top 0.254: IC5.16 68.95,43.69 | IC5.15 68.12,44.76 v68.07,44.7 | IC5.6 68.09,49.26 v67.82,49.53 68.04,49.76 IC5.5 | 61.21,55.88 61.72,55.88 61.72,56.13
  Top 0.305: 68.95,43.69 v68.58,43.43 68.58,42.67 v68.83,42.42 68.83,43.18 69.09,43.18 69.51,43.61 IC5.17 | IC5.1 69.4,51.76 v68.33,52.83
  Top 0.406: R7.2 63.27,62.93 JP1.1 | v68.58,39.88 68.33,39.63 R11.2 69.73,35.94 R12.2
  Top 0.5: L7.1 61.21,55.88 R7.2
  Top 0.813: R7.2 60.89,62.6 | 61.72,56.13 66.04,56.13 67.31,54.86 67.31,53.85 v68.33,52.83
  Bottom 0.254: v68.07,44.7 67.5,44.7
  Bottom 0.305: 68.33,43.43 C26.2 | v68.83,42.42 68.2,41.78 67.94,41.78
  Bottom 0.406: v68.58,39.88 68.58,41.08 C28.2 68.65,41.34 68.2,41.78
  Bottom 0.61: C29.2 67.82,46.17 v67.82,49.53 | v67.82,49.53 67.82,51.62 arc90 C25.2 | C24.2 v67.82,49.53 | 67.94,41.78 67.5,42.23 C26.2
  Bottom 0.813: C29.2 67.5,44.7 C26.2 67.5,43.31 68.33,43.43 v68.58,43.43 | C25.2 v68.33,52.83 C27.2
+5V  (via drill 0.4 pad 0.41)
  Top 0.406: LED1.A 22.32,81.53 22.35,81.53
  Top 0.61: L5.2 49.21,56.27 C41.1 | 44.96,68.58 44.96,68.83
  Top 0.813: C30.2 C19.1 45.28,84.14 49.4,88.27 | 49.4,88.27 50.36,89.22 C20.1 C18.2 56.45,89.15 IC3.1 IC3.2 | L5.2 46.48,68.83 | 43.94,71.12 44.96,71.12 | 43.94,68.58 44.96,68.58 | J3.2 47.24,90.42 49.4,88.27
  Top 1.016: C30.2 41.4,78.74 44.96,75.18 | 44.96,71.12 44.96,70.87 | 44.96,68.58 44.96,68.33
  other vias: 35.05,80.26 37.08,80.26 39.12,80.26 35.05,78.23 37.08,78.23 39.12,78.23 35.05,76.2 37.08,76.2 39.12,76.2 32.51,75.95 32.51,73.41 34.8,73.41 37.08,73.41 41.66,73.41 41.66,75.95 32.51,78.49 41.66,78.49 32.51,81.03 41.66,81.03 29.97,75.95 29.97,73.41 29.97,78.49 29.97,81.03 34.8,70.87 37.08,70.87 32.51,70.87 29.97,70.87 39.37,70.87 39.37,73.41 44.2,70.87 41.66,70.87 44.2,75.95 44.2,73.41 44.2,78.49 44.2,81.03 27.43,75.95 27.43,73.41 27.43,78.49 27.43,81.03 24.89,75.95 24.89,73.41 24.89,78.49 24.89,81.03 27.43,70.87 24.89,70.87 27.43,68.33 24.89,68.33 34.8,68.33 37.08,68.33 32.51,68.33 29.97,68.33 39.37,68.33 44.2,68.33 41.66,68.33 46.74,70.87 46.74,75.95 46.74,73.41 46.74,78.49 46.74,81.03 46.74,68.33 22.35,75.95 22.35,73.41 22.35,78.49 22.35,81.03 22.35,70.87 22.35,68.33
  pour Top (no thermals): 20.83,82.17 48.26,82.17 48.26,67.06 20.83,67.06
  pour Bottom (no thermals): 48.26,82.17 20.83,82.17 20.83,67.06 48.26,67.06
+5V_AMP  (via drill 0.4, 0.4 pad 0.41)
  Top 0.305: v52.58,43.43 53.03,43.87 53.03,45.03 52.91,45.34 52.91,45.72 | IC2.7 52.25,50.85 52.13,51.12 52.12,52.05 v52.5,52.43
  Top 0.406: 52.91,45.72 IC2.3
  Top 0.61: L5.1 v46.48,52.83
  Bottom 0.305: v52.5,52.43 52.45,52.4
  Bottom 0.406: v52.58,43.43 52.58,41.98 C8.2 47.75,42.16 47.12,42.8 47.12,52.35 52.45,52.4
  Bottom 0.61: v46.48,52.83 46.63,52.83 47.12,52.35
AMPOUT_N
  Top 0.254: 53.55,41.94 53.65,42.06 53.65,45.54 IC2.4
  Top 0.305: R4.2 C7.2 53.55,41.94
  Top 0.406: IC2.4 54.73,45.84 55.88,46.99 R2.1
AMPOUT_P
  Top 0.254: 53.53,50.2 53.65,50.47 53.65,53.59 C6.2
  Top 0.305: C6.2 R3.2 | IC2.5 53.53,50.2
  Top 0.406: IC2.5 54.73,50.18 55.88,49.02 R1.1
CLKOUTA
  Top 0.254: 79.96,48.05 79.76,48.26 IC5.41
  Top 0.305: 79.96,48.05 90.62,37.08 90.62,32.82 91.44,32 94.23,32 95,31.24 95,29.97 96.27,28.7 SV1.3
CLKOUTB
  Top 0.254: IC5.40 79.15,47.75 79.43,47.5
  Top 0.305: 79.43,47.5 89.85,36.83 89.85,32.33 92.71,29.46 94.36,29.46 95,28.83 95,27.69 96.27,26.42 SV1.1
DA0
  Top 0.254: IC5.42 80.28,48.76 89.41,39.62 95.25,39.62 96.27,40.64 SV1.13
DA1
  Top 0.254: IC5.43 81.05,49.26 89.41,40.89 SV1.14
DA2
  Top 0.254: SV1.15 95,42.16 89.15,42.16 81.56,49.76 IC5.44
DA3
  Top 0.254: SV1.16 88.9,43.43 82.08,50.26 IC5.45
DA4
  Top 0.254: SV1.17 95,44.7 88.65,44.7 82.59,50.76 IC5.46
DA5
  Top 0.254: SV1.18 88.39,45.97 83.11,51.26 IC5.47
DA6
  Top 0.254: IC5.48 83.63,51.76 88.14,47.24 95,47.24 SV1.19
DA7
  Top 0.254: IC5.51 76.66,54.31 76.96,54.61 77.22,54.61
  Top 0.305: SV1.20 90.55,48.51 84.45,54.61 77.22,54.61
DA8
  Top 0.254: IC5.52 76.16,54.57 76.83,55.24 77.09,55.24
  Top 0.305: SV1.21 95,49.78 90.42,49.78 84.96,55.24 77.09,55.24
DA9
  Top 0.254: IC5.53 75.66,54.84 76.71,55.88 76.96,55.88
  Top 0.305: 76.96,55.88 85.47,55.88 90.3,51.05 SV1.22
DA10
  Top 0.254: IC5.54 75.16,55.1 76.71,56.64 76.96,56.64
  Top 0.305: 76.96,56.64 85.85,56.64 90.17,52.32 95,52.32 SV1.23
DA11
  Top 0.254: IC5.55 74.66,55.36 76.71,57.4 76.96,57.4
  Top 0.305: 76.96,57.4 86.36,57.4 90.17,53.59 SV1.24
DA12
  Top 0.254: IC5.56 74.16,55.62 76.58,58.04 76.96,58.04
  Top 0.305: 76.96,58.04 86.87,58.04 90.04,54.86 95,54.86 SV1.25
DA13
  Top 0.254: IC5.57 73.66,55.88 76.58,58.8 76.83,58.8
  Top 0.305: SV1.26 89.92,56.13 87.25,58.8 76.83,58.8
DA14
  Top 0.254: IC5.58 73.16,56.27 76.45,59.56 77.09,59.56
  Top 0.305: SV1.27 95,57.4 89.92,57.4 87.76,59.56 77.09,59.56
DA15
  Top 0.254: IC5.59 72.66,56.66 76.33,60.33
  Top 0.305: 76.33,60.33 88.27,60.33 89.92,58.67 SV1.28
DITH  (via drill 0.4)
  Top 0.254: 72.69,38.63 72.43,38.9 72.43,42.26 71.66,43.02 IC5.20
  Top 0.305: SV1.4 92.71,28.19 87.63,33.27 v87,33.27 | v84.07,33.27 78,33.27 72.69,38.63
  Bottom 0.305: v87,33.27 v84.07,33.27
ENC
  Top 0.61: V1.7 91.82,23.75 SV1.2
ENC_N
  Top 0.254: IC5.12 67.59,46.26 66.04,44.7 66.04,44.2
  Top 0.406: V1.2 68.2,23.75 64.39,27.56 R14.2 64.39,36.33 R11.1 66.04,37.85 66.04,44.2
ENC_P
  Top 0.254: IC5.13 67.85,45.76 66.93,44.83 66.93,44.58 66.93,44.19
  Top 0.406: V1.1 78.23,25.02 77.6,25.65 76.96,25.65 76.33,25.02 75.69,25.02 75.06,25.65 74.42,25.65 73.79,25.02 73.28,25.02 72.64,25.65 72.14,25.65 71.5,25.02 70.99,25.02 70.36,25.65 69.98,25.65 69.34,25.02 68.96,25.02 68.58,25.4 68.58,26.16 68.07,26.67 67.31,26.67 66.93,27.05 R13.2 R12.1 66.93,44.19
FILTERED_RF
  Top 0.61: C36.1 35.56,42.23 C11.2 arc90 35.56,42.1 C15.1 arc90 35.36,40.01 L3.2
GND  (via drill 0.4, 0.4 pad 0.41, 0.4 pad 0.6)  (2 unrouted)
  Top 0.254: IC5.65 v76.96,48.01 76.96,49.02 77.16,49.02 IC5.50 77.16,53.03 v77.72,53.59 | IC5.31 77.16,48.01 IC5.65 | v71.25,54.61 71.66,54.19 IC5.61 71.66,50.26 IC5.65 | IC5.65 73.66,47.75 73.66,46.99 73.91,47.24 70.9,50.26 IC5.4 68.24,50.26 67.94,50.52 66.55,50.29 66.55,49.28 67.45,48.76 IC5.7 72.39,48.76 72.39,48.51 70.87,48.51 | IC5.10 67.44,47.24 | 66.4,47.24 v66.29,46.99 66.53,46.76 IC5.11 71.12,46.76 | v65.79,53.09 67.06,51.82 68.45,51.82 69.01,51.26 IC5.2 70.66,51.26 v70.87,51.05 70.87,48.51 | IC5.14 69.47,45.24 70.61,45.24 | 71.88,45.21 70.61,45.24 | 70.61,45.24 70.61,44.45 70.66,44.45 IC5.18 70.66,42.87 v70.36,42.42 71.16,42.88 IC5.19 71.16,48.22 70.87,48.51 | 71.12,46.76 71.12,46.74 | 71.12,46.76 71.12,47.24 69.34,47.24
  Top 0.279: 67.44,47.24 66.4,47.24
  Top 0.305: IC2.6 v52.88,51.44
  Top 0.406: R9.1 67.92,63.06 JP1.7
  other vias: 72.39,51.05 73.91,51.05 75.44,51.05 76.96,51.05 70.87,49.53 72.39,49.53 73.91,49.53 75.44,49.53 76.96,49.53 70.87,48.01 72.39,48.01 73.91,48.01 75.44,48.01 70.87,46.48 72.39,46.48 73.91,46.48 75.44,46.48 76.96,46.48 70.87,44.96 72.39,44.96 73.91,44.96 75.44,44.96 76.96,44.96 52.12,48.41 53.04,48.41 53.04,47.6 52.12,47.6 64.01,87.63 65.02,87.63 65.02,86.61 64.01,86.61 64.01,85.6 65.02,85.6 20.07,83.57 19.3,89.41 11.43,85.34 15.49,83.31 13.97,80.52 7.87,80.52 13.97,75.18 21.08,96.52 23.62,93.47 31.5,93.98 37.59,91.44 29.97,91.95 29.72,87.38 32.51,83.82 37.08,83.82 37.08,85.6 39.62,88.01 45.72,87.38 43.69,89.41 52.07,90.93 55.88,87.38 53.34,87.38 51.05,87.38 47.24,83.57 53.85,80.52 56.16,77.39 55.88,74.93 50.8,78.49 61.47,84.58 61.47,88.65 61.47,86.61 69.09,76.71 66.55,78.74 68.83,86.87 69.6,82.3 70.61,98.55 59.44,91.95 67.56,90.93 61.47,98.3 43.43,98.3 49.28,90.68 49.28,85.09 50.29,81.28 52.07,76.71 50.55,74.17 52.32,72.39 50.04,70.36 48.51,65.02 52.07,68.83 52.58,65.79 52.58,62.48 52.83,58.67 50.8,59.94 48.26,60.2 49.28,54.1 56.39,51.05 55.37,51.82 59.69,58.42 55.37,55.12 61.47,53.09 65.28,54.61 58.17,53.34 67.56,56.9 70.1,60.2 73.15,62.99 75.95,66.04 77.85,61.34 82.3,61.98 91.44,62.23 86.61,61.98 78.99,69.09 85.85,68.07 90.68,67.56 88.14,78.23 95.5,77.98 90.68,72.9 77.72,72.39 77.72,88.39 89.66,89.92 86.87,97.03 83.82,53.09 85.6,51.56 87.12,50.04 88.65,48.51 73.91,39.12 76.2,36.83 78.49,34.54 81.53,35.05 77.47,39.37 74.42,41.91 84.07,35.05 85.09,39.37 87.38,35.81 91.44,38.35 91.95,34.54 98.3,37.08 98.55,32 98.3,27.18 98.55,42.16 98.3,47.24 98.3,52.32 98.3,57.4 98.55,62.48 98.55,67.56 98.3,70.1 98.04,23.11 95,23.37 92.46,21.59 88.14,21.84 90.68,25.65 90.17,27.94 87.12,31.75 80.77,31.75 77.47,31.75 74.42,33.78 70.61,39.12 71.88,36.32 72.14,30.23 70.1,27.69 80.77,26.92 76.96,27.69 73.41,27.43 76.71,21.84 80.52,18.8 73.41,21.59 69.34,21.59 65.02,23.62 62.74,26.67 62.48,33.27 62.74,36.58 64.01,40.13 63.75,44.96 60.2,40.13 44.2,65.02 44.7,61.21 44.7,58.42 18.54,79.5 18.03,74.17 17.78,69.6 19.3,65.02 25.65,65.02 30.99,65.02 36.32,65.02 40.64,65.28 43.69,52.58 41.91,55.37 41.15,50.29 37.08,47.88 41.15,46.23 49.4,48.13 54.86,48.01 56.39,61.21 55.88,66.8 61.21,67.06 57.4,64.01 67.56,70.87 65.02,71.12 61.98,70.61 59.18,70.87 56.64,71.12 63.58,76.58 84.07,29.21 84.84,19.05 37.34,51.05 34.04,50.8 33.27,42.16 30.48,43.43 29.97,37.34 33.27,35.56 28.96,34.8 29.72,30.73 33.02,28.96 29.97,25.15 31.24,19.81 33.27,22.61 33.02,17.27 28.7,20.57 25.65,18.03 23.11,20.07 19.3,17.53 19.3,21.34 19.05,25.15 19.3,37.59 17.27,55.12 10.92,53.85 19.05,29.46 19.05,33.53 14.99,19.05 14.99,23.11 14.99,39.37 14.73,27.18 14.73,31.24 14.73,35.31 14.99,15.49 20.07,13.46 23.62,13.46 27.69,13.46 32.26,13.72 37.08,14.99 38.35,18.54 39.62,23.37 38.86,25.15 38.61,32.77 44.2,31.5 38.35,39.12 37.85,44.7 39.62,42.16 39.62,35.56 49.53,43.94 49.28,40.39 46.99,40.89 43.18,43.94 44.96,48.01 60.71,44.7 56.39,43.18 39.37,58.67 10.67,58.67 34.04,55.88 22.1,58.67 16.26,58.67 4.83,58.67 30.23,58.17 30.99,47.5 38.35,55.12 11.68,45.72 17.02,50.29 21.84,45.72 22.1,53.34 25.4,42.67 24.38,24.89 24.38,30.73 24.13,38.1 80.52,13.46 85.34,13.46 86.87,8.38 89.92,16.51 72.64,17.53 66.55,17.53 59.44,21.59 55.37,93.73 77.98,76.96 84.07,74.93 94.74,85.34 13.97,65.02 3.56,64.77 6.86,88.39 14.73,96.77 11.43,94.74 23.62,87.12 5.08,53.85 6.6,48.77 3.56,42.42 8.89,42.67 9.4,23.62 10.92,29.21 4.83,36.83 5.84,18.54 10.41,13.72 14.73,9.91 17.53,5.08 21.59,9.4 26.67,4.57 29.46,10.16 35.31,4.57 38.86,10.16 43.94,4.57 48.26,9.91 53.34,4.06 57.91,10.16 62.74,4.32 68.58,10.16 71.37,3.56 53.09,16 45.72,16 50.04,21.59 44.2,25.65 54.86,26.16 49.28,30.23 45.72,35.31 55.88,35.05 90.93,4.06 95.5,7.87 91.19,11.43 96.27,14.22 4.57,76.2 3.56,81.79 94.49,94.49 84.58,86.87 62.48,57.66 62.48,61.47 68.33,61.47 59.69,61.21 65.53,28.19 65.53,32.26 68.33,32.13 65.53,35.43 68.33,35.43 84.07,31.75 79.5,37.08 88.39,34.54 9.14,74.68 8.64,65.02 8.13,84.33 17.53,95.76 3.56,86.61 41.91,94.23 48.51,96.01 52.07,95.76 64.01,92.96 64.77,82.55 67.56,95.76 95,37.08 91.44,60.2 61.72,15.49 79.5,42.42 86.87,37.59 75.95,41.15 17.27,13.46 5.08,71.88 12.45,71.37 4.06,12.7 35.05,91.95 31.5,98.3 81.28,44.2 78.74,62.23 74.68,64.77 81.53,68.33 39.62,29.97 78.49,82.55 83.57,80.77 89.15,83.57 46.99,88.39 45.47,91.19 44.96,93.98
  pour Top (isolate 0.406, rank 2): -0.51,100.33 -1.78,63.5 43.69,63.5 44.2,62.99 44.2,60.45 43.69,59.94 -1.27,59.94 -0.51,-0.76 81.53,-1.02 81.79,32 71.63,42.67 71.63,44.45 72.26,44.45 72.26,43.18 83.44,31.5 83.19,-0.76 100.33,-0.76 100.58,100.58 75.95,101.6 75.95,68.07 72.14,63.5 72.14,52.32 71.63,52.32 71.63,72.14 57.15,72.14 56.64,72.64 56.64,74.42 57.15,74.93 71.63,74.93 71.63,100.33
  pour Bottom (isolate 0.406, rank 2): -0.76,100.33 -1.78,63.5 43.69,63.5 44.2,62.99 44.2,60.45 43.69,59.94 -1.27,59.94 -0.76,-0.76 81.53,-1.02 81.79,32 71.63,42.67 71.63,44.45 72.26,44.45 72.26,43.18 83.44,31.5 83.19,-0.76 100.08,-0.76 100.58,100.58 75.95,102.36 75.95,68.07 72.14,63.25 72.14,52.32 71.5,52.32 71.63,72.14 57.15,72.14 56.64,72.64 56.64,74.42 57.15,74.93 71.63,74.93 71.63,100.33
IN_N
  Top 0.254: R2.2 59.5,47.05 | C33.2 63.61,47.06 64.31,47.76 IC5.9
  Top 0.406: 59.5,47.05 62.48,47.05 C33.2
IN_P
  Top 0.254: C33.1 63.61,48.96 64.31,48.26 IC5.8
  Top 0.406: C33.1 59.44,48.96 R1.2
MODE  (via drill 0.4)
  Top 0.254: IC5.62 71.16,53.3 70.36,54.1 70.36,55.24 v71.12,56.01
  Top 0.305: JP1.2 JP1.4 JP1.6 JP1.8
  Top 0.406: v68.83,58.04 JP1.2
  Bottom 0.406: v71.12,56.01 69.09,57.78 v68.83,58.04
N$1
  Top 0.406: TR1.3 43.88,50.16 R5.1
N$2
  Top 0.305: R10.2 22.86,15.56 22.86,15.49 | D1.2 34.04,15.54 34.04,15.49
  Top 0.61: 17.08,45.27 X1.1 17.02,16.76 18.29,15.49 22.86,15.49 34.04,15.49 34.29,15.49 35.56,16.76 C1.1
N$3
  Top 0.61: TR1.4 36.32,49.28 35.56,48.51 C36.2
N$4
  Top 0.254: 51.63,50.2 51.51,50.55 51.51,53.54 C6.1
  Top 0.305: C6.1 R3.1
  Top 0.406: 51.63,50.2 IC2.8 48.08,50.18 R5.2
N$5
  Top 0.254: 51.63,45.81 51.51,45.64 51.49,41.68 C7.1
  Top 0.305: IC2.1 51.63,45.81 | C7.1 R4.1
  Top 0.406: IC2.1 48.08,45.84 R6.2
N$6
  Top 0.406: R7.1 62.93,66.8 R8.2 64.77,66.49 JP1.3
N$7
  Top 1.016: C34.+ 32.99,89.34 34.8,89.34 | 34.8,89.34 C31.2 38.61,89.34 C40.1 39.44,95.77 F1.P$2 | IC1.3 34.8,86.61 34.8,89.34
N$9
  Top 0.406: JP1.5 66.04,66.49 R8.1 67.75,66.8 R9.2
N$12
  Top 0.406: LED1.C R15.2
N$13
  Top 1.016: D2.C F1.P$1
N$14
  Top 0.406: TR1.1 43.88,45.85 R6.1
N$15  (via drill 0.4)
  Top 0.406: TR1.2 v41.78,48.01
  Bottom 0.406: v41.78,48.01 C37.2
N$16
  Top 0.61: L1.1 35.36,24.5 arc90 C13.2 35.56,22.42 arc90 C9.2 arc90 35.56,22.29 C1.2
N$17
  Top 0.61: L2.1 35.36,31.11 arc90 C14.2 35.56,29.02 arc90 C10.2 arc90 35.56,28.89 C13.1 arc90 35.36,26.8 L1.2
N$18
  Top 0.61: L3.1 35.36,37.71 arc90 C15.2 35.56,35.63 arc90 C12.2 arc90 35.56,35.49 C14.1 arc90 35.36,33.41 L2.2
N$19
  Top 0.61: IC3.5 58.37,82.79 C39.1
OFA
  Top 0.254: IC5.60 72.16,57.18 72.52,57.53
  Top 0.305: SV1.32 78.74,63.75 72.52,57.53
PGA
  Top 0.254: 70.36,57.91 69.09,56.64 69.09,53.48 IC5.64
  Top 0.305: 70.36,57.91 78.74,66.29 SV1.34
RAND
  Top 0.254: IC5.63 70.66,52.91 69.72,53.85 69.72,56.01 70.41,56.69
  Top 0.305: SV1.31 95,65.02 78.74,65.02 70.41,56.69
VCM  (via drill 0.4)
  Top 0.254: v52.27,44.55 52.27,45.77 IC2.2 | IC5.3 68.62,50.76 68.2,51.18 63.95,51.18 C22.2
  Top 0.305: C22.2 64.07,51.3 v61.47,51.31
  Bottom 0.305: v61.47,51.31 59.18,51.31 58.42,50.55 58.42,45.72 57.4,44.58
  Bottom 0.406: 57.4,44.58 v52.27,44.55
VDD  (via drill 0.4, 0.4 pad 0.41)
  Top 0.254: IC5.49 77.81,52.41 | IC5.32 77.7,43.31
  Top 0.406: 77.81,52.41 77.98,52.45 v79.25,52.83 | 77.7,43.31 77.85,42.93 | C4.2 86.8,25.02 V1.8 | 85.53,25.11 C42.2 85.53,36.39 80.89,41.03 | 80.89,41.03
  Top 0.61: v79.76,44.96 79.79,44.16 81.32,42.62 C5.2 81.89,42.02 80.89,41.03 C38.1 79,40.84 77.86,41.9 77.85,42.93 | V1.8 85.53,25.11
  Top 0.813: L4.2 v76.2,68.33
  Bottom 0.61: C35.1 80.01,53.27 v79.25,52.83 C3.2 79.76,52.51 v79.76,44.96
  Bottom 0.813: v76.2,68.33 80.08,64.45 C35.1

### Text on the board
tPlace: Revision A